# EAGLE schematic LilyPadSR (EAGLE 6.0)
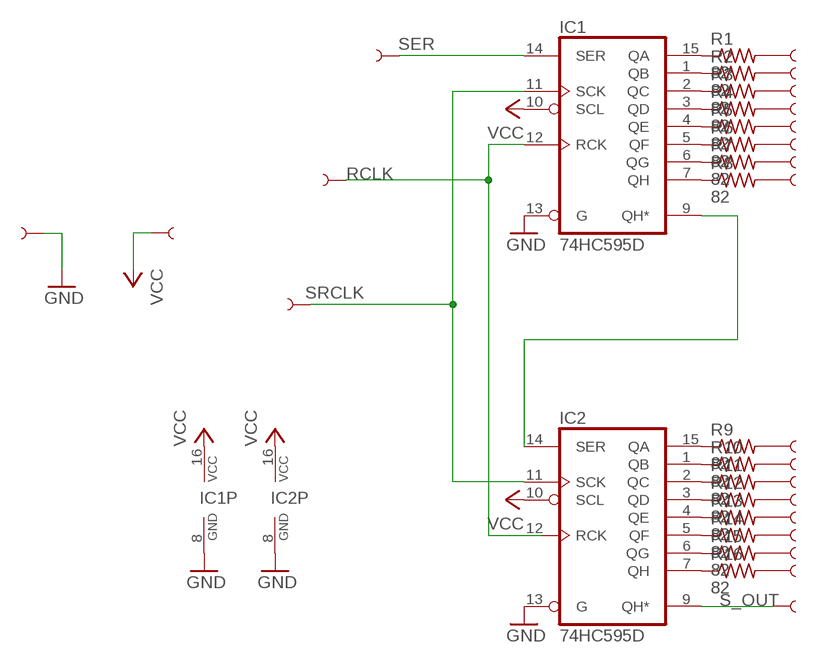
[diagram p0: schematic, sheet 1]

## Parts
IC1  74HC595D  [SO16]
IC2  74HC595D  [SO16]
R1  82  R-US_R0201  [R0201]
R2  82  R-US_R0201  [R0201]
R3  82  R-US_R0201  [R0201]
R4  82  R-US_R0201  [R0201]
R5  82  R-US_R0201  [R0201]
R6  82  R-US_R0201  [R0201]
R7  82  R-US_R0201  [R0201]
R8  82  R-US_R0201  [R0201]
R9  82  R-US_R0201  [R0201]
R10  82  R-US_R0201  [R0201]
R11  82  R-US_R0201  [R0201]
R12  82  R-US_R0201  [R0201]
R13  82  R-US_R0201  [R0201]
R14  82  R-US_R0201  [R0201]
R15  82  R-US_R0201  [R0201]
R16  82  R-US_R0201  [R0201]
U$1  SEWTAP1  [PETAL-LONG-1]
U$2  SEWTAP1  [PETAL-LONG-1]
U$3  SEWTAP1  [PETAL-LONG-1]
U$4  SEWTAP1  [PETAL-LONG-1]
U$5  SEWTAP1  [PETAL-LONG-1]
U$6  SEWTAP1  [PETAL-LONG-1]
U$7  SEWTAP1  [PETAL-LONG-1]
U$8  SEWTAP1  [PETAL-LONG-1]
U$9  SEWTAP1  [PETAL-LONG-1]
U$10  SEWTAP1  [PETAL-LONG-1]
U$11  SEWTAP1  [PETAL-LONG-1]
U$12  SEWTAP1  [PETAL-LONG-1]
U$13  SEWTAP1  [PETAL-LONG-1]
U$14  SEWTAP1  [PETAL-LONG-1]
U$15  SEWTAP1  [PETAL-LONG-1]
U$16  SEWTAP1  [PETAL-LONG-1]
U$17  SEWTAP1  [PETAL-LONG-1]
U$18  SEWTAP1  [PETAL-LONG-1]
U$19  SEWTAP1  [PETAL-LONG-1]
U$20  SEWTAP1  [PETAL-LONG-1]
U$21  SEWTAP1  [PETAL-LONG-1]
U$22  SEWTAP1  [PETAL-LONG-1]

## Nets
GND: IC1.8(GND) IC1.13(G) IC2.8(GND) IC2.13(G) U$22.1
N$1: IC1.15(QA) R1.1
N$2: IC1.1(QB) R2.1
N$3: IC1.2(QC) R3.1
N$4: IC1.3(QD) R4.1
N$5: IC1.4(QE) R5.1
N$6: IC1.5(QF) R6.1
N$7: IC1.6(QG) R7.1
N$8: IC1.7(QH) R8.1
N$9: IC2.15(QA) R9.1
N$10: IC2.1(QB) R10.1
N$11: IC2.2(QC) R11.1
N$12: IC2.3(QD) R12.1
N$13: IC2.4(QE) R13.1
N$14: IC2.5(QF) R14.1
N$15: IC2.6(QG) R15.1
N$16: IC2.7(QH) R16.1
N$17: IC1.9(QH*) IC2.14(SER)
N$18: R1.2 U$2.1
N$19: R2.2 U$3.1
N$20: R3.2 U$4.1
N$21: R4.2 U$5.1
N$22: R5.2 U$6.1
N$23: R6.2 U$7.1
N$24: R7.2 U$8.1
N$25: R8.2 U$9.1
N$26: R9.2 U$10.1
N$27: R10.2 U$11.1
N$28: R11.2 U$12.1
N$29: R12.2 U$13.1
N$30: R13.2 U$14.1
N$31: R14.2 U$15.1
N$32: R15.2 U$16.1
N$33: R16.2 U$17.1
RCLK: IC1.12(RCK) U$19.1
S_OUT: IC2.9(QH*) U$1.1
SER: IC1.14(SER) U$18.1
SRCLK: IC2.11(SCK) U$20.1
VCC: IC1.10(SCL) IC1.16(VCC) IC2.10(SCL) IC2.16(VCC) U$21.1
Unconnected: IC1.11(SCK) IC2.12(RCK)

## Library data of the parts
IC1 IC2 = 74xx-eu:74*595: 8-bit SHIFT REGISTER, output latch
R1-R16 = rcl:R-US_: RESISTOR, American symbol
U$1-U$22 = LilyPad-Wearables:SEWTAP